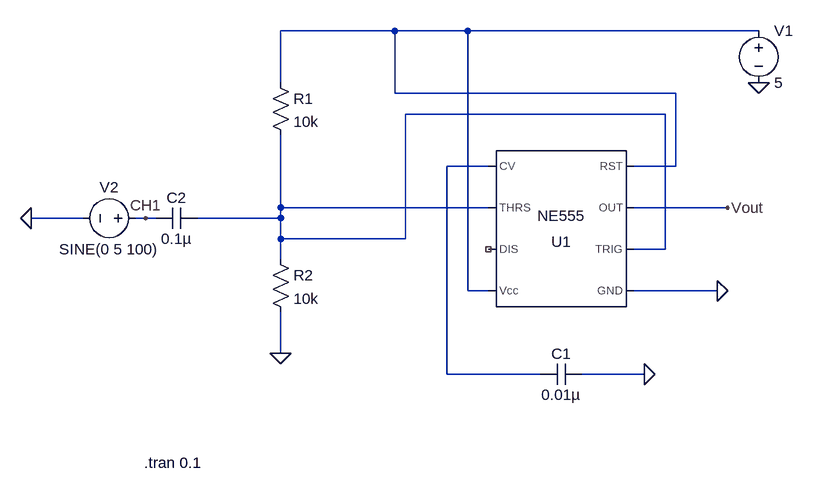
[diagram p0: schematic schmitt-555.asc]
schmitt-555.asc, the LTspice schematic file:
Version 4
SHEET 1 880 680
WIRE 48 -112 -128 -112
WIRE 160 -112 48 -112
WIRE 608 -112 160 -112
WIRE -128 -32 -128 -112
WIRE 48 -16 48 -112
WIRE 480 -16 48 -16
WIRE 464 16 64 16
WIRE 192 96 128 96
WIRE 480 96 480 -16
WIRE 480 96 416 96
WIRE -128 160 -128 48
WIRE 192 160 -128 160
WIRE 560 160 416 160
WIRE -432 176 -512 176
WIRE -336 176 -352 176
WIRE -320 176 -336 176
WIRE -128 176 -128 160
WIRE -128 176 -256 176
WIRE -128 208 -128 176
WIRE 64 208 64 16
WIRE 64 208 -128 208
WIRE 464 224 464 16
WIRE 464 224 416 224
WIRE -128 240 -128 208
WIRE 160 288 160 -112
WIRE 192 288 160 288
WIRE 544 288 416 288
WIRE -128 384 -128 320
WIRE 128 416 128 96
WIRE 272 416 128 416
WIRE 432 416 336 416
FLAG 544 288 0
FLAG 560 160 Vout
FLAG 608 -32 0
FLAG 432 416 0
FLAG -128 384 0
FLAG -512 176 0
FLAG -336 176 CH1
SYMBOL Misc\\NE555 304 192 R180
SYMATTR InstName U1
SYMBOL voltage 608 -128 R0
WINDOW 123 0 0 Left 0
WINDOW 39 0 0 Left 0
SYMATTR InstName V1
SYMATTR Value 5
SYMBOL cap 336 400 R90
WINDOW 0 0 32 VBottom 2
WINDOW 3 32 32 VTop 2
SYMATTR InstName C1
SYMATTR Value 0.01µ
SYMBOL res -144 -48 R0
SYMATTR InstName R1
SYMATTR Value 10k
SYMBOL res -144 224 R0
SYMATTR InstName R2
SYMATTR Value 10k
SYMBOL cap -256 160 R90
WINDOW 0 0 32 VBottom 2
WINDOW 3 32 32 VTop 2
SYMATTR InstName C2
SYMATTR Value 0.1µ
SYMBOL voltage -336 176 R90
WINDOW 0 -32 56 VBottom 2
WINDOW 3 32 56 VTop 2
WINDOW 123 0 0 Left 0
WINDOW 39 0 0 Left 0
SYMATTR InstName V2
SYMATTR Value SINE(0 5 100)
TEXT -338 552 Left 2 !.tran 0.1

The netlist it stands for:
* schmitt-555.asc
XU1 0 N002 Vout N001 N003 N002 NC_01 N001 NE555  ; pins GND TRIG OUT RST CV THRS DIS Vcc
V1 N001 0 5
C1 0 N003 0.01µ
R1 N001 N002 10k
R2 N002 0 10k
C2 N002 CH1 0.1µ
V2 CH1 0 SINE(0 5 100)
.tran 0.1
.lib NE555.sub
.backanno
.end